# EAGLE schematic controller (EAGLE 7.7.0)
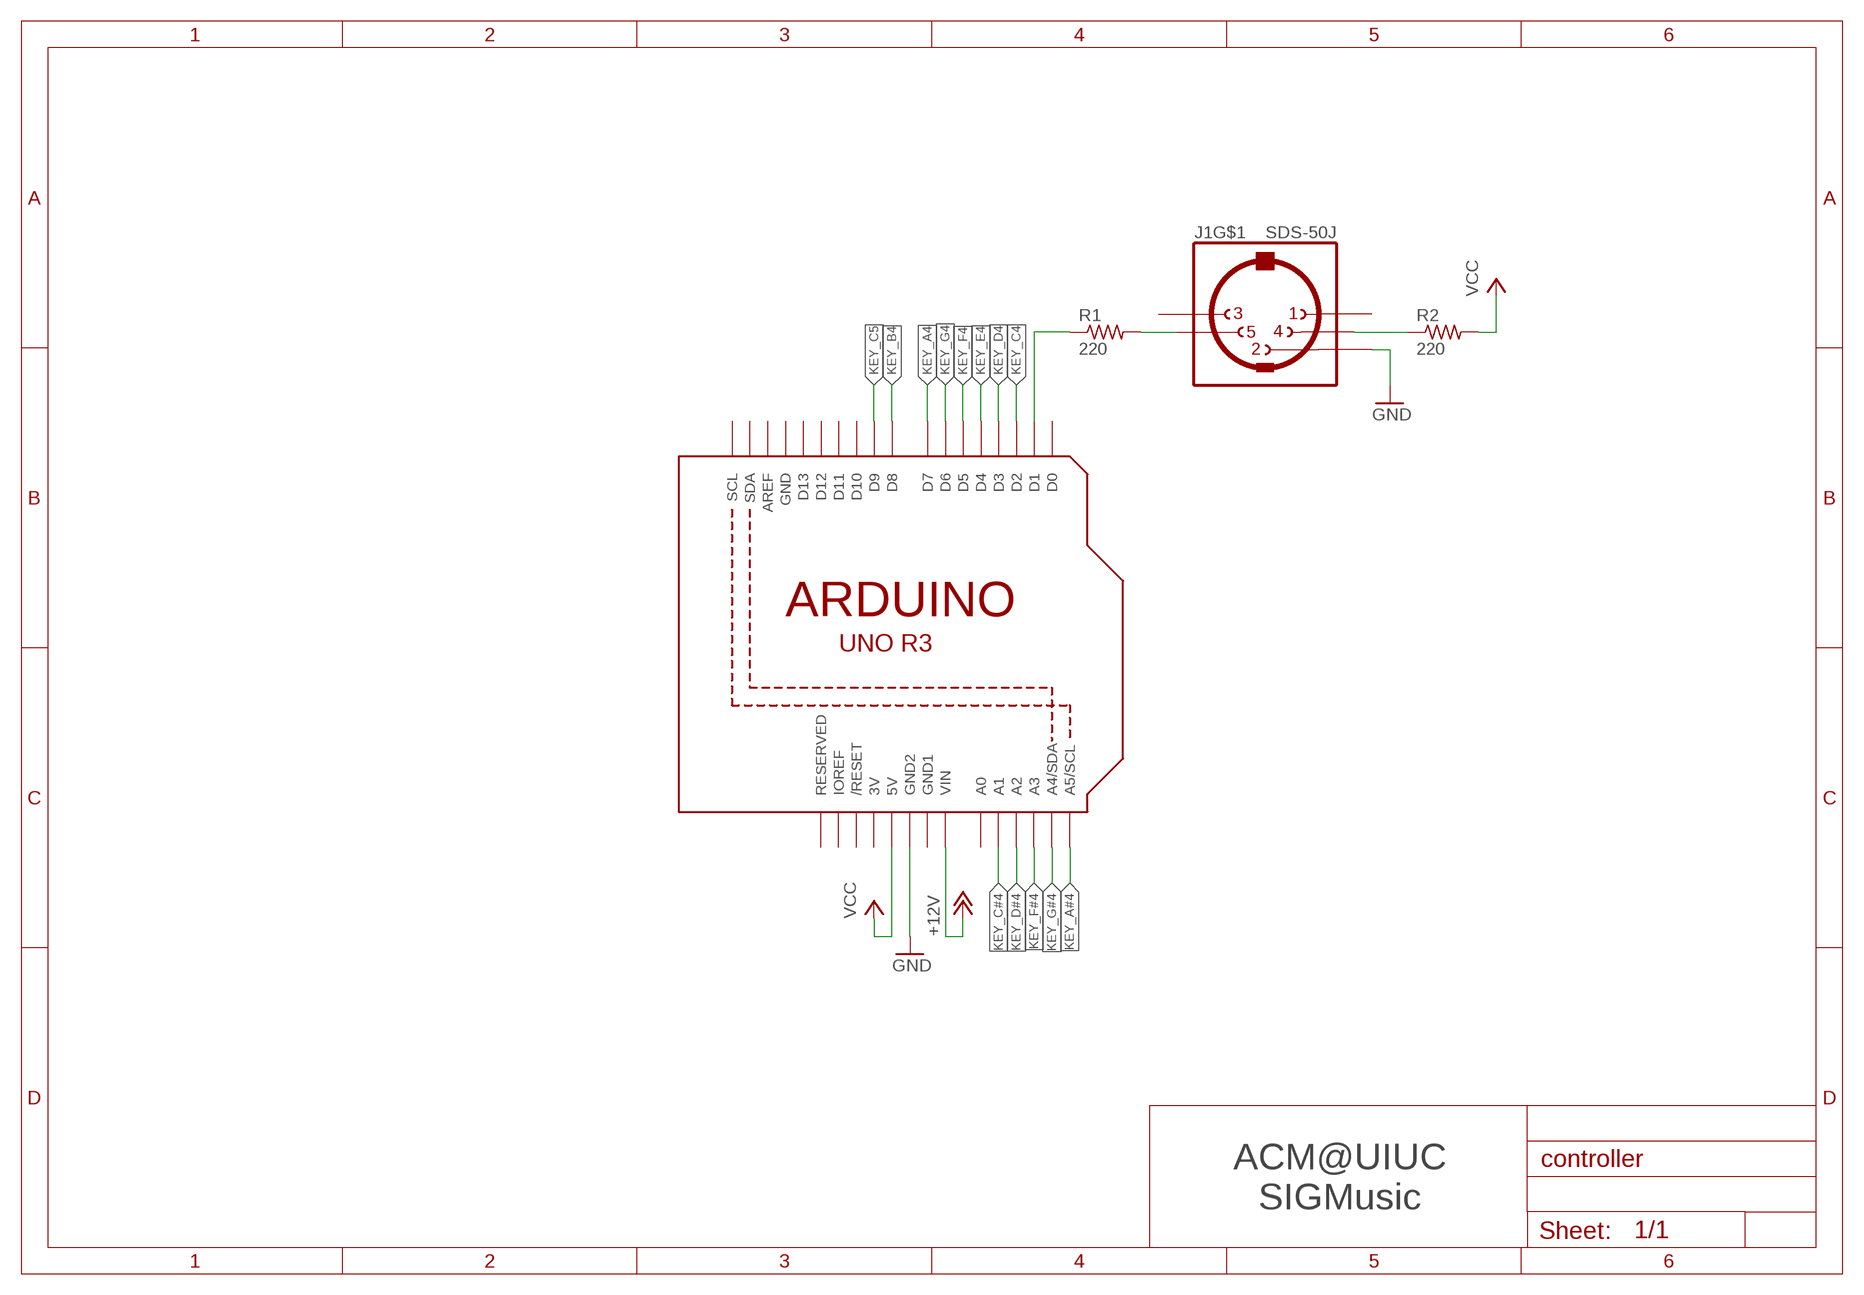
[diagram p0: schematic, sheet 1]

## Parts
J1  SDS-50J  MIDIJACK  [CP-2350]
R1  220  R-US_0207/10  [0207/10]
R2  220  R-US_0207/10  [0207/10]
U1  ARDUINOR3-BPLACE  [ARDUINOR3-BPLACE]

## Nets
+12V: U1.VIN
GND: J1.2 U1.GND2
KEY_A4: U1.D7
KEY_A#4: U1.A5(A5/SCL)
KEY_B4: U1.D8
KEY_C4: U1.D2
KEY_C5: U1.D9
KEY_D4: U1.D3
KEY_D#4: U1.A2
KEY_E4: U1.D4
KEY_F4: U1.D5
KEY_F#4: U1.A3
KEY_G4: U1.D6
KEY_G#4: U1.A4(A4/SDA)
N$1: R1.1 U1.D1
N$2: J1.5 R1.2
N$4: J1.4 R2.1
VCC: R2.2 U1.5V
Unconnected: J1.1 J1.3 J1.PE1(MT) J1.PE2(MT) J1.PE(MT) J1.PE@(MT) U1.A0 U1.A1 U1.AREF U1.D0 U1.D10 U1.D11 U1.D12 U1.D13 U1.IOREF U1.RESERVED U1.RESET(/RESET) U1.SCL U1.SDA

## Notes on the sheet
- ACM@UIUC
  SIGMusic

## Power pins joined to a net without a drawn wire
3V: U1.3V
GND: U1.GND
GND1: U1.GND1

## Library data of the parts
J1 = adafruit:MIDIJACK: DIN 5 jack also known as MIDI jack A modification of conn-hirshman:MAB5SH with two options for the grounding 'teeth'
R1 R2 = rcl:R-US_: RESISTOR, American symbol
U1 = adafruit:ARDUINOR3: This is a new object for the new Arduino R3 - with extra pins that you may want to use (such as IOref, and duplicated A4/A5